# Altium schematic sheet DSO_Power.SchDoc: Schematic_Name
size A4; CompanyName: University of Melbourne; Engineer: Your Name Here; DocumentNumber: 1; Revision: 0.1; SheetNumber: 11; SheetTotal: 11; Title_Project: Project_Title; StudentNo: Student No.
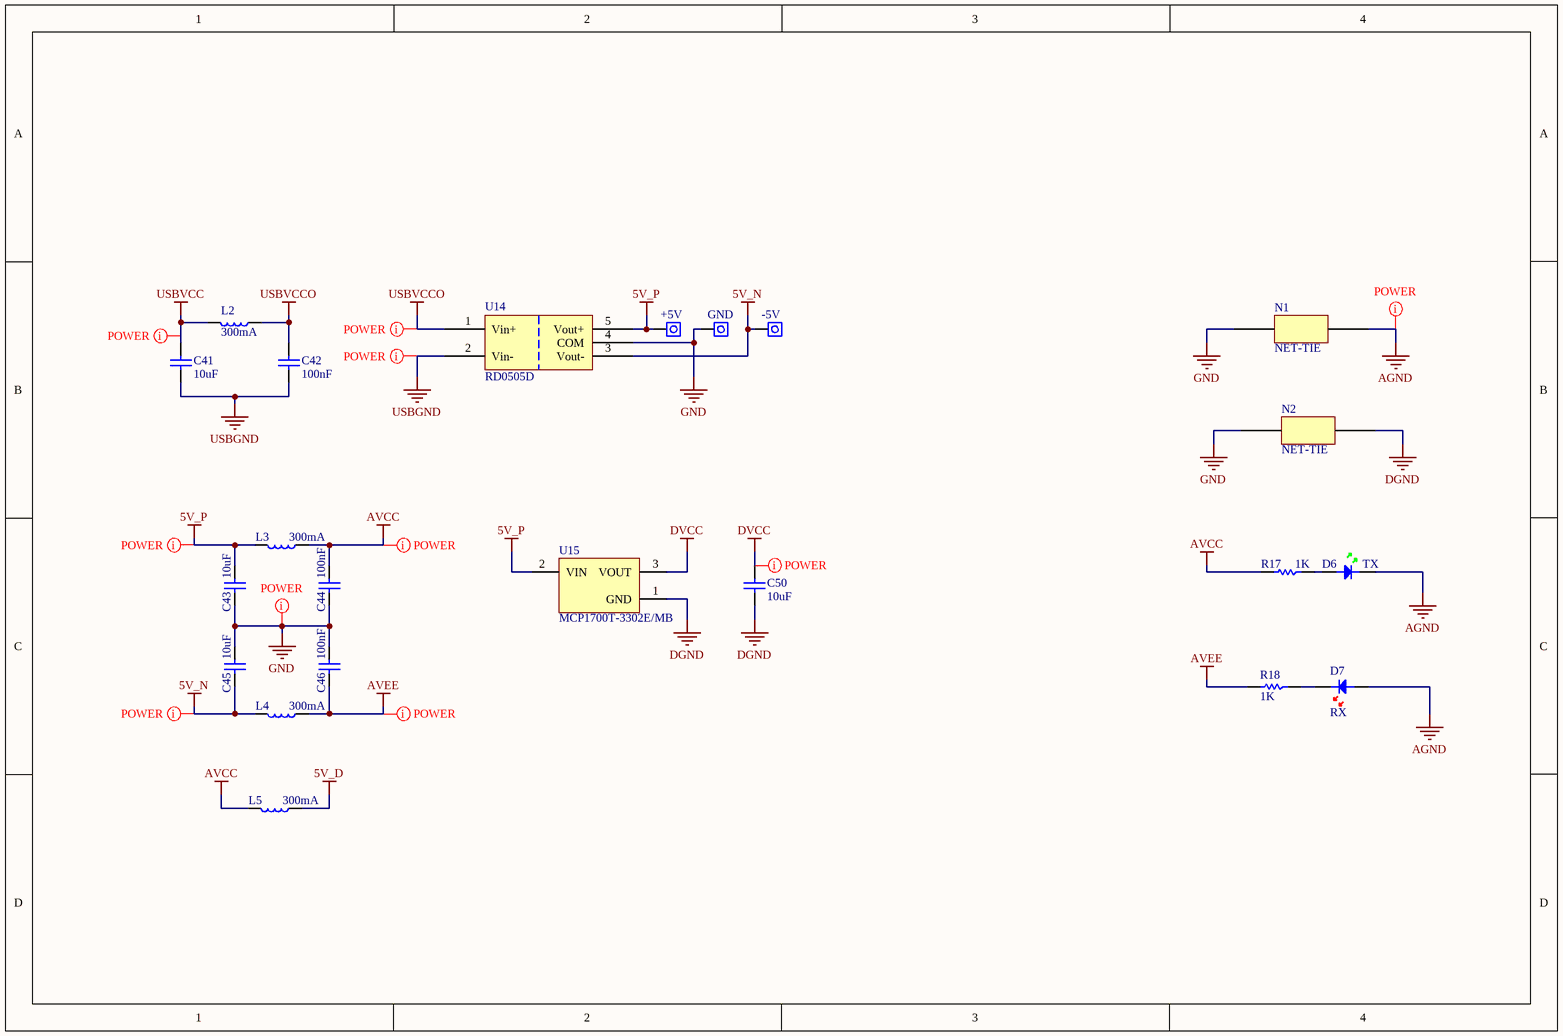
[diagram p0: DSO_Power.SchDoc]

## Parts
C41  10uF  [0805]
C42  100nF  [0805]
C43  10uF  [0805]
C44  100nF  [0805]
C45  10uF  [0805]
C46  100nF  [0805]
C50  10uF  [0805C]
D6  TX  [0805D-GREEN]
D7  RX  [0805D-RED]
L2  300mA  [0805]
L3  300mA  [0805]
L4  300mA  [0805]
L5  300mA  [0805]
N1  NET-TIE  [NET-TIE]  (net tie, no BOM)
N2  NET-TIE  [NET-TIE]  (net tie, no BOM)
R17  1K  [0805]
R18  1K  [0805]
TP4  +5V  [PIN 1.8mm]
TP5  GND  [PIN 1.8mm]
TP6  -5V  [PIN 1.8mm]
U14  RD0505D  [SIP_NMG]
U15  MCP1700T-3302E/MB  [SOT89]

## Nets
5V_D: L5.1
5V_N: C45.2 L4.2 TP6.1 U14.3(Vout-)
5V_P: C43.1 L3.2 TP4.1 U14.5(Vout+) U15.2(VIN)
AGND: D6.K D7.A N1.1
AVCC: C44.1 L3.1 L5.2 R17.2
AVEE: C46.2 L4.1 R18.2
DGND: C50.2 N2.1 U15.1(GND)
DVCC: C50.1 U15.3(VOUT)
GND: C43.2 C44.2 C45.1 C46.1 N1.0 N2.0 TP5.1 U14.4(COM)
USBGND: C41.2 C42.2 U14.2(Vin-)
USBVCC: C41.1 L2.2
USBVCCO: C42.1 L2.1 U14.1(Vin+)
NetD6_A: D6.A R17.1
NetD7_K: D7.K R18.1

## Layout directives
net class Undefined: 5V_N, 5V_P, AGND, AVCC, AVEE, DVCC, GND, USBGND, USBVCC, USBVCCO

## Library data of the parts
C41-C46 = C: Capacitor; Class I: Passive; Revision: July-2002: Re-released for DXP Platform.
  C41 C43 C45: Value: 10uF
  C42 C44 C46: Value: 100nF
C50 = C: Capacitor; Reviewed by: RM - 2018/08/05; Revision: July-2002: Re-released for DXP Platform.; Supplier 1: *; Supplier Part Number 1: *; Value: 10uF
D6 = LED GREEN: Light Emitting Diode; Reviewed by: RM - 2018/08/05; Revision: July-2002: Re-released for DXP Platform.; Supplier 1: Digi-Key; Supplier Part Number 1: 160-1423-1-ND
D7 = LED RED: Light Emitting Diode; Reviewed by: RM - 2018/08/05; Revision: July-2002: Re-released for DXP Platform.; Supplier 1: Digi-Key; Supplier Part Number 1: 475-1415-1-ND
L2-L5 = I: Inductor; Code_IEC: 1005; Published: 8-Jun-2000; LatestRevisionDate: 17-Jul-2002; LatestRevisionNote: Re-released for DXP Platform.; PackageReference: 0402-A; Publisher: Altium Limited; Code_JEITA: 0402; Value: 300mA
R17 R18 = R: Resistor; Value: 1K
TP4-TP6 = WIRE: Pad
U14 = RD0505D: (ADV) DC to DC converter 5V in +-5V out; Reviewed by: RM - 2018/08/05; Supplier Part Number 1: 945-1136-ND; Supplier 1: Digi-Key
U15 = MCP1700T: Low Quiescent Current LDO, 3-Pin SOT-89, Extended Temperature, Tape and Reel; Reviewed by: RM - 2018/08/05; Supplier 1: Digi-Key; Supplier Part Number 1: MCP1700T3302EMBCT-ND